# EasyEDA Pro project TJMakes_Template.eprj

# Schematic schematic1
Create Date: 2024-02-23; Page Name: P1; Project Name: TJMakes_Relay - Copy; Schematic Name: schematic1; Update Date: 2024-02-26; Company: EasyEDA.com; Drawn: EasyEDA; Page Size: A4; Part Number: JLCPCB-002; Reviewed: EasyEDA; Version: V0.1
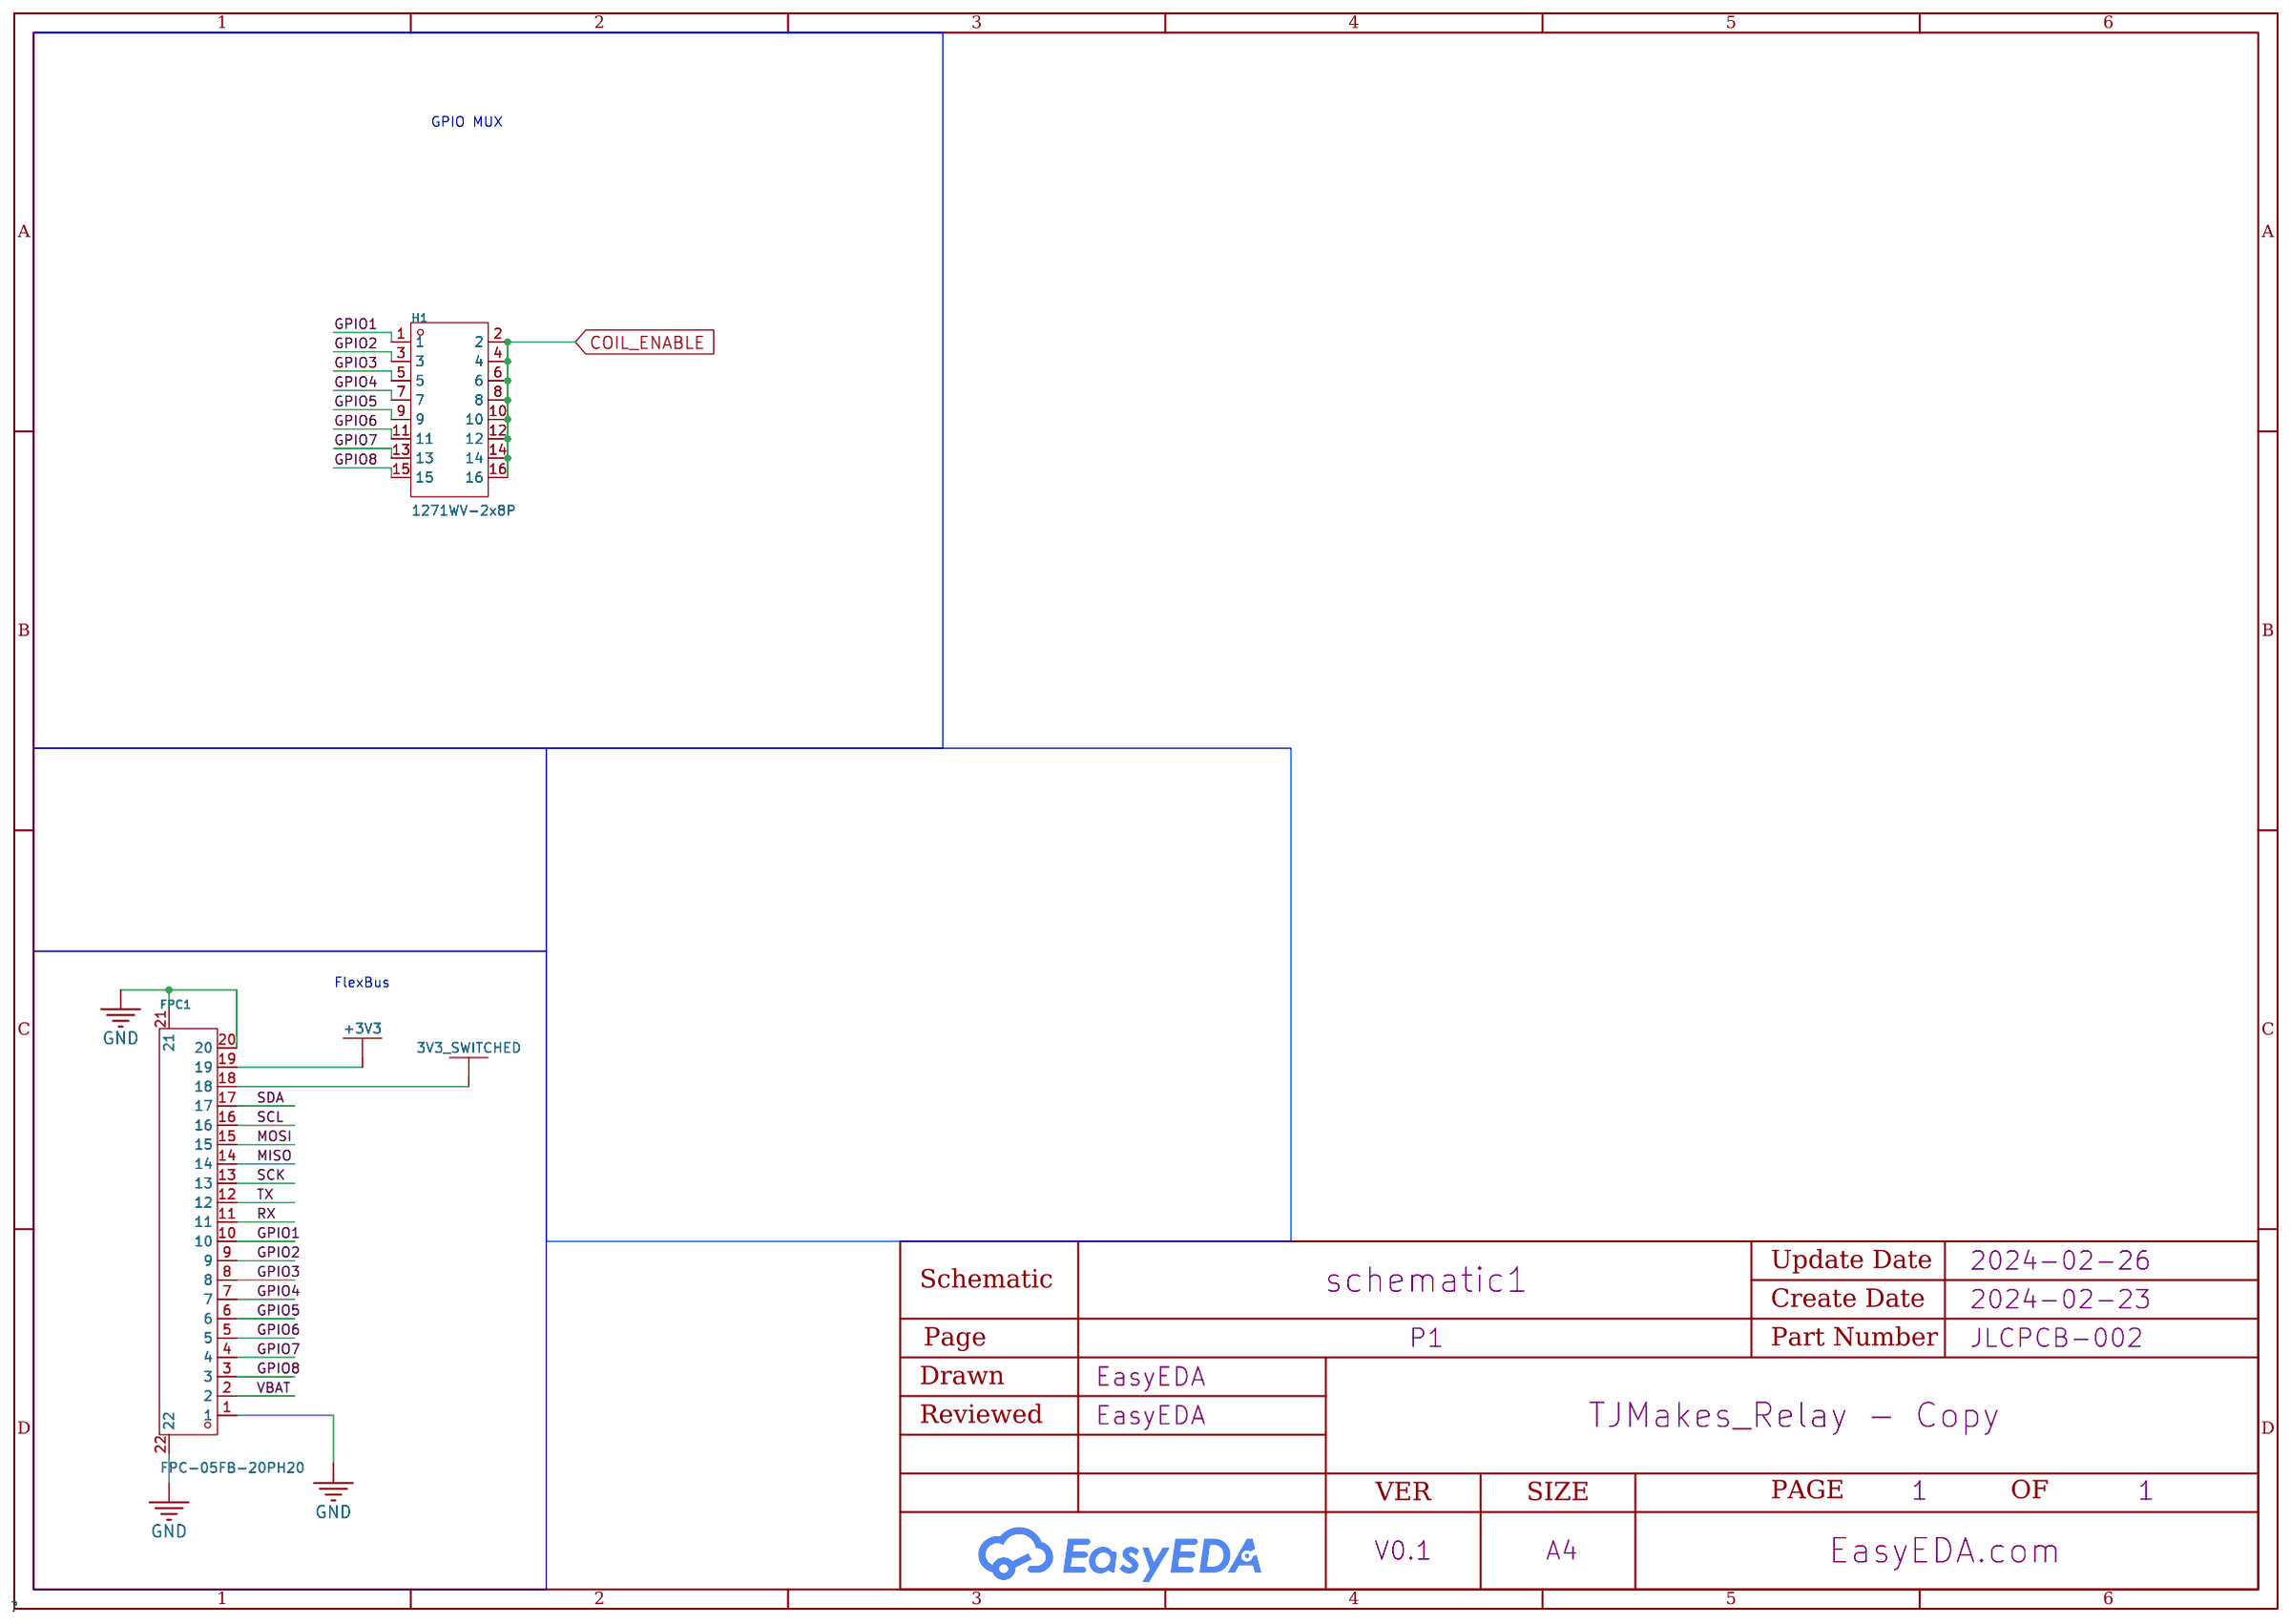
[diagram p0: schematic sheet]

## Parts
FPC1  FPC-05FB-20PH20  [FPC-SMD_20P-P0.50_FPC-05FB-20PH20]
H1  1271WV-2x8P  [HDR-TH_16P-P1.27-V-M-R2-C8-S1.27]

## Library data of the parts
FPC1 = FPC-05FB-20PH20: Pitch:0.5mm Number of Contacts:20P Locking Feature:Clamshell FFC, FCB Thickness:0.3mm FFC, FCB Thickness:0.3mm Contact Type:Double-sided contacts/up and down connection Mounting Type:Surface Mount Height Above Board:2mm Operating Temperature Range:-25℃~+8; LCSC Part Name: 间距:0.5mm P数:20P 翻盖式 双侧触点/上下接; Supplier Part: C2856830; Manufacturer: XUNPU(讯普); Supplier Footprint: SMD,P=0.5mm,卧贴; JLCPCB Part Class: Extended Part; Datasheet: https://atta.szlcsc.com/upload/public/pdf/source/20210922/C2856830_32DC95BE77527398880E7D75F765EF2A.pdf; Supplier: LCSC; Pitch: 0.5mm; Number of Contacts: 20P; Locking Feature: Clamshell; FFC, FCB Thickness: 0.3mm; Contact Type: Double-sided contacts/up and down connection; Mounting Type: Surface Mount; Height Above Board: 2mm; Operating Temperature Range: -25℃~+85℃
H1 = KH-1.27PH180-2X8P-L7.2: Pin Structure:2x8P Pitch:1.27mm Row Spacing:1.27mm Circluar Pins/Square Pins:Square Pins Mounting Type:Straight Number of Rows:双排 Number of Pins:16P Current Rating (Max):1A Voltage Rating (Max):- Length of Mating Pin:3.9mm Insulation Height:1mm Length of; LCSC Part Name: 间距:1.27mm 2x8P 直插 方针; Supplier Part: C7470092; Manufacturer: kinghelm(金航标); Supplier Footprint: 插件,P=1.27mm; JLCPCB Part Class: Extended Part; Datasheet: https://atta.szlcsc.com/upload/public/pdf/source/20211228/40BBFCDE63818F8CDD890F8C15594070.pdf; Supplier: LCSC; Pin Structure: 2x8P; Pitch: 1.27mm; Row Spacing: 1.27mm; Circluar Pins/Square Pins: Square Pins; Mounting Type: Straight; Number of Rows: 双排; Number of Pins: 16P; Current Rating (Max): 1A; Length of Mating Pin: 3.9mm; Insulation Height: 1mm; Length of End Connection Pin: 2.3mm; Operating Temperature Range: -40℃~+105℃

## Nets
3V3_SWITCHED: FPC1.18
+3V3: FPC1.19
GND: FPC1.1 FPC1.20 FPC1.21 FPC1.22
VBAT: FPC1.2
COIL_ENABLE: H1.2 H1.4 H1.6 H1.8 H1.10 H1.12 H1.14 H1.16
GPIO1: FPC1.10 H1.1
GPIO2: FPC1.9 H1.3
GPIO3: FPC1.8 H1.5
GPIO4: FPC1.7 H1.7
GPIO5: FPC1.6 H1.9
GPIO6: FPC1.5 H1.11
GPIO7: FPC1.4 H1.13
GPIO8: FPC1.3 H1.15
MISO: FPC1.14
MOSI: FPC1.15
RX: FPC1.11
SCK: FPC1.13
SCL: FPC1.16
SDA: FPC1.17
TX: FPC1.12

## Notes on the sheet
- GPIO MUX
- FlexBus

# Board PCB1
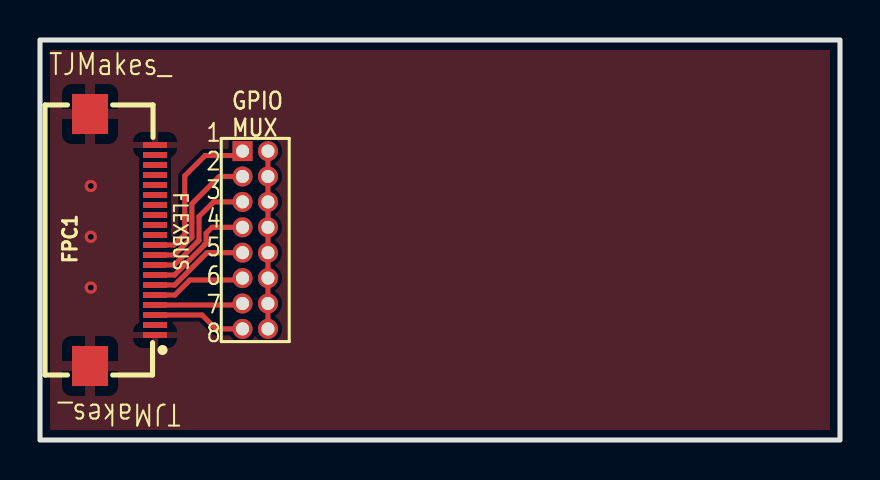
[diagram p1: board, top side]
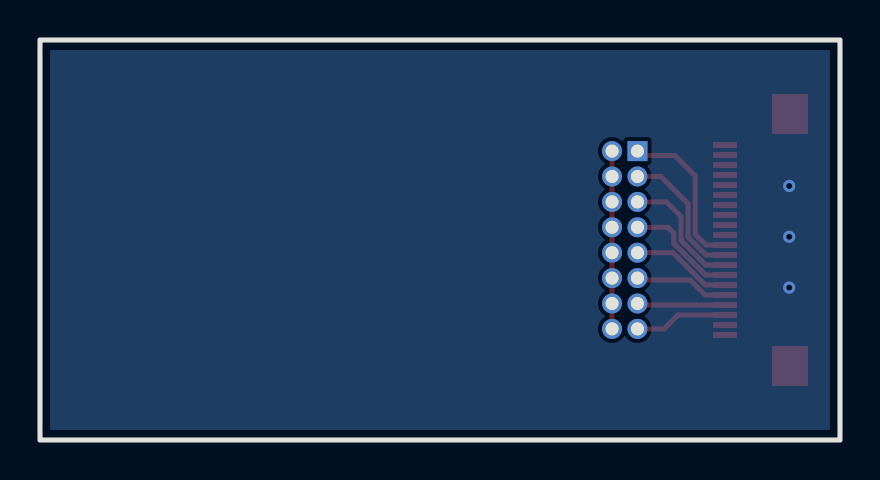
[diagram p2: board, bottom side, seen from below]

Outline 40 x 20 mm; copper layers: Top Layer, Bottom Layer. Coordinates in mm from the lower left corner of the outline.
Outline path: rectangle 0,20 40,0
Stack: Top Layer 0.035mm / Dielectric1 1.51mm FR4 er 4.5 / Bottom Layer 0.035mm

## Design rules (mm)
template: JLCPCB Capability(Two Layers Board)
spacing copperThickness1oz (default): track to track 0.102, other pairs 0.152 to 0.3
spacing copperThickness2oz: track to track 0.203, other pairs 0.152 to 0.3
track width copperThickness1oz (default): min 0.127, default 0.254, max 2.54
track width copperThickness2oz: min 0.203, default 0.254, max 2.54
differential pair differentialPair (default): width min 0.127, default 0.254, max 2.54; gap min 0.152, default 0.152
via viaSize (default): diameter min 0.5, default 0.61, max 10; hole min 0.3, default 0.305, max 6.3

## Placement (name value [footprint] x y rotation side)
FPC1  FPC-05FB-20PH20  [FPC-SMD_20P-P0.50_FPC-05FB-20PH20]  4.13 10 270 top
H1  1271WV-2x8P  [HDR-TH_16P-P1.27-V-M-R2-C8-S1.27]  10.76 10 270 top

## Footprints (pads in the part's own frame, mm; a bottom-side part is the same pattern mirrored in y, then rotated)
FPC-SMD_20P-P0.50_FPC-05FB-20PH20
  rect 0.3x1.2 smd: 1(4.75,1.625) 2(4.25,1.625) 3(3.75,1.625) 4(3.25,1.625) 5(2.75,1.625) 6(2.25,1.625) 7(1.75,1.625) 8(1.25,1.625) 9(0.75,1.625) 10(0.25,1.625) 11(-0.25,1.625) 12(-0.75,1.625) 13(-1.25,1.625) 14(-1.75,1.625) 15(-2.25,1.625) 16(-2.75,1.625) 17(-3.25,1.625) 18(-3.75,1.625) 19(-4.25,1.625) 20(-4.75,1.625)
  rect 2x1.8 smd: 21(-6.3,-1.625) 22(6.3,-1.625)
HDR-TH_16P-P1.27-V-M-R2-C8-S1.27
  rect 1x1 hole 0.65: 1(-4.445,-0.635)
  round 1 hole 0.65: 2(-4.445,0.635) 3(-3.175,-0.635) 4(-3.175,0.635) 5(-1.905,-0.635) 6(-1.905,0.635) 7(-0.635,-0.635) 8(-0.635,0.635) 9(0.635,-0.635) 10(0.635,0.635) 11(1.905,-0.635) 12(1.905,0.635) 13(3.175,-0.635) 14(3.175,0.635) 15(4.445,-0.635) 16(4.445,0.635)

## Nets
As in the schematic.

## Via types
v1: diameter 0.61, hole 0.304, Top Layer to Bottom Layer, 3 vias

## Routing (per net, layer and track width the routed paths; a pad name or vN(x,y) marks a point on that pad's centre or on a via; arc(x,y) is an arc through that point)
GND:
  vias: v1(2.54,12.7) v1(2.54,10.16) v1(2.54,7.62)
COIL_ENABLE: length 9
  Top Layer w0.254: 11.3,5.46 H1.16 H1.14 H1.12 H1.10 H1.8 H1.6 H1.4 H1.2
GPIO1: length 8
  Top Layer w0.254: H1.1 9.91,14.22 8.25,14.22 7.24,13.21 7.24,10.29 6.7,9.75 FPC1.10
GPIO2: length 7
  Top Layer w0.254: H1.3 8.96,13.17 7.59,11.81 7.59,10.14 7.24,9.78 7.24,9.78 6.71,9.25 FPC1.9
GPIO3: length 6.4
  Top Layer w0.254: H1.5 8.68,11.91 7.95,11.18 7.95,9.99 7.87,9.92 7.87,9.91 6.72,8.75 FPC1.8
GPIO4: length 5.7
  Top Layer w0.254: H1.7 8.6,10.64 8.31,10.34 8.31,9.84 8.23,9.77 8.23,9.75 6.73,8.25 FPC1.7
GPIO5: length 5
  Top Layer w0.254: H1.9 8.35,9.36 6.73,7.75 FPC1.6
GPIO6: length 4.7
  Top Layer w0.254: H1.11 10.03,8 7.49,8 6.74,7.25 FPC1.5
GPIO7: length 4.4
  Top Layer w0.254: H1.13 10.05,6.75 FPC1.4
GPIO8: length 4.7
  Top Layer w0.254: FPC1.3 8.1,6.25 8.8,5.56 H1.15

## Copper pours and planes (outline as drawn; the poured copper is in the pictures)
GND on Top Layer: 0,20 40,20 40,0 0,0
GND on Bottom Layer: 0,20 40,20 40,0 0,0

## Text on the board
Top Silkscreen Layer: FLEXBUS | GPIO / MUX | 1 / 2 / 3 / 4 / 5 / 6 / 7 / 8 | TJMakes_
